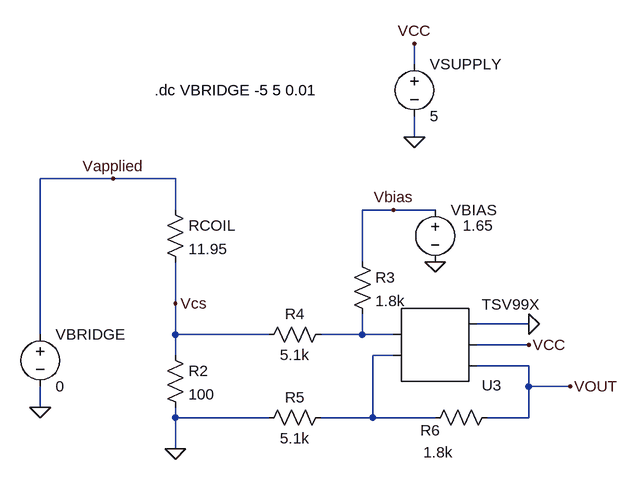
[diagram p0: schematic CURRENT_SENSE_TSV991AILT_new_coil.asc]
CURRENT_SENSE_TSV991AILT_new_coil.asc, the LTspice schematic file:
Version 4
SHEET 1 880 696
WIRE -256 -448 -256 -480
WIRE -256 -336 -256 -368
WIRE -720 -272 -832 -272
WIRE -624 -272 -720 -272
WIRE -624 -224 -624 -272
WIRE -288 -224 -336 -224
WIRE -224 -224 -288 -224
WIRE -336 -144 -336 -224
WIRE -624 -80 -624 -144
WIRE -80 -48 -160 -48
WIRE -832 -32 -832 -272
WIRE -624 -32 -624 -80
WIRE -480 -32 -624 -32
WIRE -336 -32 -336 -64
WIRE -336 -32 -400 -32
WIRE -288 -32 -336 -32
WIRE -80 -16 -160 -16
WIRE -624 0 -624 -32
WIRE -288 0 -320 0
WIRE -80 16 -160 16
WIRE -80 48 -80 16
WIRE -16 48 -80 48
WIRE -832 80 -832 48
WIRE -624 96 -624 80
WIRE -480 96 -624 96
WIRE -320 96 -320 0
WIRE -320 96 -400 96
WIRE -224 96 -320 96
WIRE -80 96 -80 48
WIRE -80 96 -144 96
WIRE -624 144 -624 96
FLAG -256 -336 0
FLAG -80 -48 0
FLAG -80 -16 VCC
FLAG -832 80 0
FLAG -256 -480 VCC
FLAG -624 144 0
FLAG -224 -144 0
FLAG -16 48 VOUT
FLAG -624 -80 Vcs
FLAG -288 -224 Vbias
FLAG -720 -272 Vapplied
SYMBOL voltage -832 -48 R0
WINDOW 123 0 0 Left 0
WINDOW 39 0 0 Left 0
SYMATTR InstName VBRIDGE
SYMATTR Value 0
SYMBOL voltage -256 -464 R0
WINDOW 123 0 0 Left 0
WINDOW 39 0 0 Left 0
SYMATTR InstName VSUPPLY
SYMATTR Value 5
SYMBOL res -640 -240 R0
SYMATTR InstName RCOIL
SYMATTR Value 11.95
SYMBOL res -640 -16 R0
SYMATTR InstName R2
SYMATTR Value 100
SYMBOL res -352 -160 R0
SYMATTR InstName R3
SYMATTR Value 1.8k
SYMBOL res -384 -48 R90
WINDOW 0 0 56 VBottom 2
WINDOW 3 32 56 VTop 2
SYMATTR InstName R4
SYMATTR Value 5.1k
SYMBOL res -384 80 R90
WINDOW 0 0 56 VBottom 2
WINDOW 3 32 56 VTop 2
SYMATTR InstName R5
SYMATTR Value 5.1k
SYMBOL res -128 80 R90
WINDOW 0 51 103 VBottom 2
WINDOW 3 54 91 VTop 2
SYMATTR InstName R6
SYMATTR Value 1.8k
SYMBOL voltage -224 -240 R0
WINDOW 3 43 40 Left 2
WINDOW 123 0 0 Left 0
WINDOW 39 0 0 Left 0
SYMATTR Value 1.65
SYMATTR InstName VBIAS
SYMBOL AutoGenerated\\TSV99X -224 -16 M180
SYMATTR InstName U3
TEXT -656 -408 Left 2 !.dc VBRIDGE -5 5 0.01

The netlist it stands for:
* CURRENT_SENSE_TSV991AILT_new_coil.asc
VBRIDGE Vapplied 0 0
VSUPPLY VCC 0 5
RCOIL Vapplied Vcs 11.95
R2 Vcs 0 100
R3 Vbias N001 1.8k
R4 N001 Vcs 5.1k
R5 N002 0 5.1k
R6 VOUT N002 1.8k
VBIAS Vbias 0 1.65
* U3: TSV99X (symbol AutoGenerated\TSV99X not available, pins judged from their places): pin1=N002 pin2=N001 pin3=VOUT pin4=VCC pin5=0
.dc VBRIDGE -5 5 0.01
.backanno
.end